# Altium project MegaD-328.PrjPcb
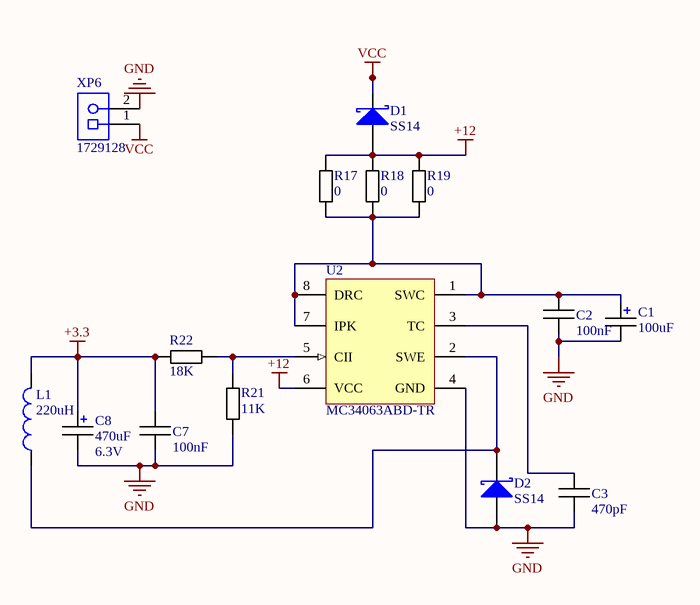
[diagram p0: Power.SchDoc]
3 sheets, 64 parts. Net scope: flat (ports and power ports of the same name join across sheets).
Board file: PCB.PcbDoc
Sheets:
  Power.SchDoc
  MCU.SchDoc
  LAN.SchDoc

## Sheet Power.SchDoc
size A4

### Parts
C1  Val: 100uF  [ECAP_SMD_6.3mmx5.4mm]  (hidden comment: CAP_ELEC_SMD)
C2  Val: 100nF  [CAPC1206(3216)170_L]  (hidden comment: CAP_SMD)
C3  Val: 470pF  [CAPC1206(3216)170_L]  (hidden comment: CAP_SMD)
C7  Val: 100nF  [CAPC1206(3216)170_L]  (hidden comment: CAP_SMD)
C8  Rated Capacitance: 470uF  Rated Voltage: 6.3V  [ECAP_SMD_8mmx10mm]  (hidden comment: CAP_ELEC_SMD)
D1  SS14  [DO-214]
D2  SS14  [DO-214]
L1  220uH  [SDR1006_SMD]
R17  Val: 0  [RESC1206(3216)_L]  (hidden comment: RES_SMD)
R18  Val: 0  [RESC1206(3216)_L]  (hidden comment: RES_SMD)
R19  Val: 0  [RESC1206(3216)_L]  (hidden comment: RES_SMD)
R21  Val: 11K  [RESC1206(3216)_L]  (hidden comment: RES_SMD)
R22  Val: 18K  [RESC1206(3216)_L]  (hidden comment: RES_SMD)
U2  MC34063ABD-TR  [SO-8_M]
XP6  1729128  [PHOE-1729128-2_V]

### Nets
+3.3: C7.2 C8.1 L1.2 R22.2
+12: D1.2(A) R17.2 R18.2 R19.2 U2.6(VCC)
GND: C1.2 C2.1 C3.1 C7.1 C8.2 D2.2(A) R21.2 U2.4(GND) XP6.2
VCC: D1.1(K) XP6.1
NetC1_1: C1.1 C2.2 R17.1 R18.1 R19.1 U2.1(SWC) U2.7(IPK) U2.8(DRC)
NetC3_2: C3.2 U2.3(TC)
NetD2_1: D2.1(K) L1.1 U2.2(SWE)
NetR21_1: R21.1 R22.1 U2.5(CII)

### Library data of the parts
C2 C3 C7 = CAP_SMD: Ceramic capacitor, 0805
D1 D2 = SS14: Schottky Rectifier, 1.1 W, -65 to 125 degC, 2-Pin SMD, RoHS, Tape and Reel; Manufacturer: Fairchild; Configuration: SINGLE; Diode Element Material: SILICON; Power Dissipation Limit-Max (W): 1.1; Additional Feature: FREEWHEELINGDIODE; Signal Diode Type: SIGNALDIODE; Number of Elements: 1; JEDEC-95 Code: DO-214AC; Rep Pk Reverse Voltage-Max (V): 40; Package Body Material: PLASTIC/EPOXY; CAGE Code: 1HBD3,07933,59621,7D893; Peak Reflow Temperature (Cel): 260; Package Shape: RECTANGULAR; Manufacturer URL: https://www.fairchildsemi.com/; JESD-97 Code: e3; Package Reference: DO-214AC-2; RoHS Compliant: YES; Package Description: 2-Pin Surface Mount Device, Body 4.375 x 2.725 mm; Technology: SCHOTTKY; Surface Mount: YES; Datasheet URL: http://www.onlinecomponents.com/datasheet/ss14.aspx?p=11369800; Terminal Form: CBEND; Package Style: SMALLOUTLINE; Number of Terminals: 2; JESD-30 Code: R-PDSO-C2; Average Forward Current-Max (A): 1; Terminal Finish: MATTETIN; Datasheet Version: Oct-13; Terminal Position: DUAL; Package URL: https://www.fairchildsemi.com/package-drawings/DO/DO214AC.pdf; Moisture Sensitivity Level: 1; Lead Free: YES
L1 = Inductor power: Inductor for Power Circuits; Manufacturer: TDK; Online Catalog: VLCFSeries; Catalog Drawings: VLCF50[20,20-(1,3),28-2]SeriesTopVLCF50[20,20-(1,3),28-2]SeriesFootprintVLCF50[20,20-(1,3)]SeriesSide; Current - Saturation: 2.62A; Frequency - Test: 100kHz; EDA / CAD Models: DownloadfromAcceleratedDesigns; Material - Core: Ferrite; Type: Wirewound; DC Resistance (DCR): 43mOhmMax; Inductance: 2.2µH; Tolerance: ±30%; Shielding: Shielded; Other Names: 445-4557-1; Size / Dimension: 0.197"Lx0.197"W(5.00mmx5.00mm); Datasheet Version: 04/2016; Package Description: 2-Pin Surface Mount Device, Body 5 x 5 mm; Package Reference: VLCF5020T-3; Package / Case: Nonstandard; Series: VLCF; Current Rating: 2.62A; Manufacturer URL: http://www.tdk.com/; Category: Inductors,Coils,Chokes; Height - Seated (Max): 0.079"(2.00mm); Mounting Technology: SurfaceMount; Family: FixedInductors; Datasheet URL: https://product.tdk.com/info/en/catalog/datasheets/inductor_commercial_power_vlcf5020-3_en.pdf; Standard Package: 1; Mounting Type: SurfaceMount; Operating Temperature: -40°C~105°C; Packaging: CutTape(CT)
R17-R19 R21 R22 = RES_SMD: RES0805
U2 = MC34063A: DC/DC converter control circuit, 8-Pin SO, Tape and Reel; PackageReference: SO8; DatasheetVersion: Nov-2007; PackageDescription: 8-Pin Small Outline Integrated Circuit 1.27 mm Pitch; ComponentLink3URL: http://www.st.com/internet/com/TECHNICAL_RESOURCES/TECHNICAL_LITERATURE/PACKAGE_INFORMATION/CD00004680.pdf; ComponentLink2Description: Datasheet; PackageVersion: Dec-2002; ComponentLink1URL: http://www.st.com; ComponentLink2URL: http://www.st.com/internet/com/TECHNICAL_RESOURCES/TECHNICAL_LITERATURE/DATASHEET/CD00001232.pdf; ComponentLink1Description: Manufacturer URL; ComponentLink3Description: Package Specification; Code_IPC: SOIC127P600-8; Code_JEDEC: MS-012-AA
XP6 = Terminal_2_Green: PCB Terminal Block, 13.5 A, 400 V, 2-Pin THD, RoHS, Bulk; Manufacturer: Phoenix Contact; Package Version: 03/2015; No. of Rows: 1; Pitch: 5.08mm; No. of Positions: 2; Voltage Rating: 400V; Current Rating: 13500mA; Manufacturer URL: http://www.phoenixcontact.com/; Datasheet URL: https://datasheet.ciiva.com/16046/1729128-16046181.pdf; RoHS: TRUE; Package URL: https://www.phoenixcontact.com/online/portal/pi/pxc/product_detail_page/!ut/p/b1/3VdJjqNKFDxLH8AFycySyWY2ozFsEPOMMQaDOX1XedGL_1Vdm5YXJleknhSKeBkvI6EA8ncAo3AYoDhBQGco6KN7VURTdemj9us_IEKEZo_YHiPAEWEFmDGOHMORkqKYCORBZxgL7ZoaZYcbFFUZ3fqxSY6GOuxydWUuHqz1ynmMFygu583Bob0Ewr6Sd_l-5m-kAueHiB0jpRwZwe58wwtkpxtMYd_LmGcDRU02dRNEyWt6Y2ti5pSyJ_reIkzIulrqApdnbT11V5jnCKbYNCvhEM1MCpPByat_X379-iThf08CI5GfOPqfBeS3BRoBOdD55AKVv0iLwCMq-2BrzXWSGRH7pUGD9uwXQjiph3xL0DKQwdGa0JImiIOmBNOestqgwTHSSs2oOep-78apyXQBvNi8ZLaFjvjWvcaUEBu0MC6Wbe-d6mB0FAebo2lUWinqYaZs5DAYzV0RP9yitUjnGJ0iI9xhZkT42OCQNUJJhkgWINNQLP2JFP6OpMg3JCVg70jqHT0lvKOnhHf0lPuOnnLf0VPuWx6_dxwUIvwk5WMkT0kLL1mh61l2yZVSzG3pYV_bqo-mj6uMKwKwdnnW8Jh5RTOJzMOA5c-eJDaZQw4mTMPH02PvS_ZAqNVjVTo2WyYLkwH_KU1mmmG5kjRhDqPXLwwVHvVOjCM60-fpXvTDfMGW1PVFVS1r4e4yVDk4ZdNbkUHvqPqQSeian4UD39fNKmachqdJ1NJbyk8rXT9mXTvPk3oE5meulKGgiruPJek-4I9hTT6G8ZLOyRSm2RRVbThERQad5OS28hdt4YW4vG0stgYYzsWsK4_7y6DZMjJSCqri1kyiZR5vD7pwIrNR7QwPHTcLTI5qT7eRlpHrdGiupYlqQDJ7zy_CND8fWWBoLRXxk1RVcXiBQwbTD4Xi7KL-FuO94t9xaqweXzH; PartNumber: 1729128; Package Description: 2-Pin Through Hole Device, Body 8.1 x 10.16 mm, Pitch 5.08 mm; Datasheet Version: 12/2013; Mounting Technology: ThroughHole; Orientation: Horizontal; Package Reference: 1729128-2; Packing: Bulk

## Sheet MCU.SchDoc
size A4
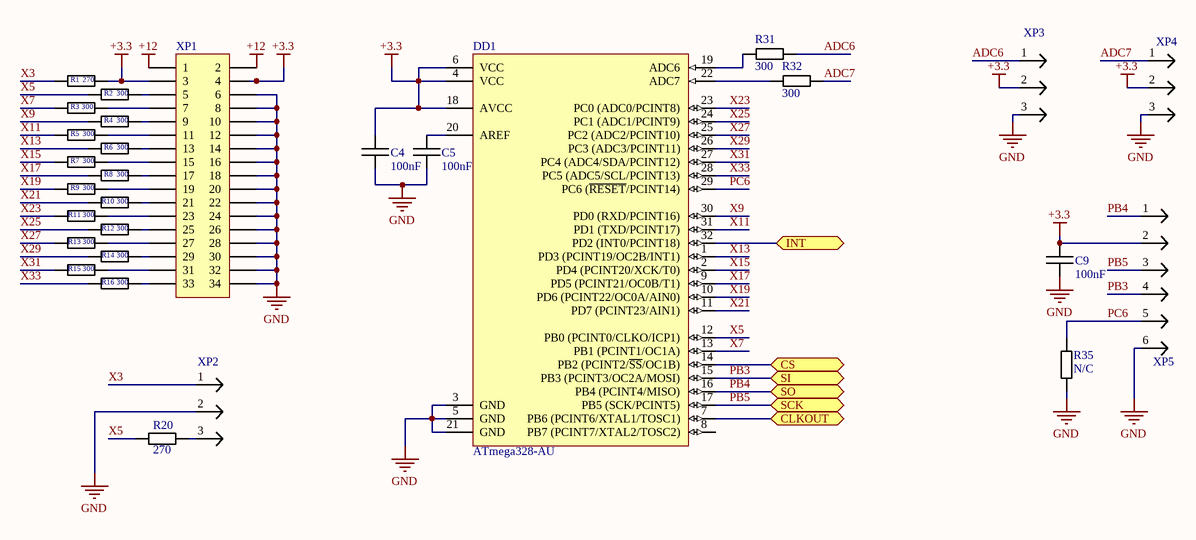
[diagram p1: MCU.SchDoc]

### Parts
C4  Val: 100nF  [CAPC1206(3216)170_L]  (hidden comment: CAP_SMD)
C5  Val: 100nF  [CAPC1206(3216)170_L]  (hidden comment: CAP_SMD)
C9  Val: 100nF  [CAPC1206(3216)170_L]  (hidden comment: CAP_SMD)
DD1  ATmega328-AU  [32A_L]
R1  Val: 270  [RESC1206(3216)_L]  (hidden comment: RES_SMD)
R2  Val: 300  [RESC1206(3216)_L]  (hidden comment: RES_SMD)
R3  Val: 300  [RESC1206(3216)_L]  (hidden comment: RES_SMD)
R4  Val: 300  [RESC1206(3216)_L]  (hidden comment: RES_SMD)
R5  Val: 300  [RESC1206(3216)_L]  (hidden comment: RES_SMD)
R6  Val: 300  [RESC1206(3216)_L]  (hidden comment: RES_SMD)
R7  Val: 300  [RESC1206(3216)_L]  (hidden comment: RES_SMD)
R8  Val: 300  [RESC1206(3216)_L]  (hidden comment: RES_SMD)
R9  Val: 300  [RESC1206(3216)_L]  (hidden comment: RES_SMD)
R10  Val: 300  [RESC1206(3216)_L]  (hidden comment: RES_SMD)
R11  Val: 300  [RESC1206(3216)_L]  (hidden comment: RES_SMD)
R12  Val: 300  [RESC1206(3216)_L]  (hidden comment: RES_SMD)
R13  Val: 300  [RESC1206(3216)_L]  (hidden comment: RES_SMD)
R14  Val: 300  [RESC1206(3216)_L]  (hidden comment: RES_SMD)
R15  Val: 300  [RESC1206(3216)_L]  (hidden comment: RES_SMD)
R16  Val: 300  [RESC1206(3216)_L]  (hidden comment: RES_SMD)
R20  Val: 270  [RESC1206(3216)_L]  (hidden comment: RES_SMD)
R31  Val: 300  [RESC1206(3216)_L]  (hidden comment: RES_SMD)
R32  Val: 300  [RESC1206(3216)_L]  (hidden comment: RES_SMD)
R35  Val: N/C  [RESC1206(3216)_L]  (hidden comment: RES_SMD)
XP1  (no value)  [HDR2X17]
XP2  PBS-03  [PBS-03]  (value not drawn)
XP3  PLS-03  [PLS-03]  (value not drawn)
XP4  PLS-03  [PLS-03]  (value not drawn)
XP5  PLS-03_2  [PLS-03_2]  (value not drawn)

### Ports
CLKOUT (bidir), CS (bidir), INT (bidir), SCK (bidir), SI (bidir), SO (bidir)

### Nets
+3.3: C4.2 C9.2 DD1.4(VCC) DD1.6(VCC) DD1.18(AVCC) R1.2 XP1.3 XP1.4 XP3.2 XP4.2 XP5.2
+12: XP1.1 XP1.2
GND: C4.1 C5.1 C9.1 DD1.3(GND) DD1.5(GND) DD1.21(GND) R35.1 XP1.6 XP1.8 XP1.10 XP1.12 XP1.14 XP1.16 XP1.18 XP1.20 XP1.22 XP1.24 XP1.26 XP1.28 XP1.30 XP1.32 XP1.34 XP2.2 XP3.3 XP4.3 XP5.6
ADC6: R31.2 XP3.1
ADC7: R32.2 XP4.1
PB3: DD1.15(PB3_(PCINT3/OC2A/MOSI)) XP5.4 ; port SI
PB4: DD1.16(PB4_(PCINT4/MISO)) XP5.1 ; port SO
PB5: DD1.17(PB5_(SCK/PCINT5)) XP5.3 ; port SCK
PC6: DD1.29(PC6_(~{RESET}/PCINT14)) R35.2 XP5.5
X3: R1.1 XP2.1
X5: DD1.12(PB0_(PCINT0/CLKO/ICP1)) R2.1 R20.1
X7: DD1.13(PB1_(PCINT1/OC1A)) R3.1
X9: DD1.30(PD0_(RXD/PCINT16)) R4.1
X11: DD1.31(PD1_(TXD/PCINT17)) R5.1
X13: DD1.1(PD3_(PCINT19/OC2B/INT1)) R6.1
X15: DD1.2(PD4_(PCINT20/XCK/T0)) R7.1
X17: DD1.9(PD5_(PCINT21/OC0B/T1)) R8.1
X19: DD1.10(PD6_(PCINT22/OC0A/AIN0)) R9.1
X21: DD1.11(PD7_(PCINT23/AIN1)) R10.1
X23: DD1.23(PC0_(ADC0/PCINT8)) R11.1
X25: DD1.24(PC1_(ADC1/PCINT9)) R12.1
X27: DD1.25(PC2_(ADC2/PCINT10)) R13.1
X29: DD1.26(PC3_(ADC3/PCINT11)) R14.1
X31: DD1.27(PC4_(ADC4/SDA/PCINT12)) R15.1
X33: DD1.28(PC5_(ADC5/SCL/PCINT13)) R16.1
NetC5_2: C5.2 DD1.20(AREF)
NetDD1_7: DD1.7(PB6_(PCINT6/XTAL1/TOSC1)) ; port CLKOUT
NetDD1_14: DD1.14(PB2_(PCINT2/~{SS}/OC1B)) ; port CS
NetDD1_19: DD1.19(ADC6) R31.1
NetDD1_22: DD1.22(ADC7) R32.1
NetDD1_32: DD1.32(PD2_(INT0/PCINT18)) ; port INT
NetR2_2: R2.2 XP1.5
NetR3_2: R3.2 XP1.7
NetR4_2: R4.2 XP1.9
NetR5_2: R5.2 XP1.11
NetR6_2: R6.2 XP1.13
NetR7_2: R7.2 XP1.15
NetR8_2: R8.2 XP1.17
NetR9_2: R9.2 XP1.19
NetR10_2: R10.2 XP1.21
NetR11_2: R11.2 XP1.23
NetR12_2: R12.2 XP1.25
NetR13_2: R13.2 XP1.27
NetR14_2: R14.2 XP1.29
NetR15_2: R15.2 XP1.31
NetR16_2: R16.2 XP1.33
NetR20_2: R20.2 XP2.3

Not connected (* = marked no-connect by the designer): DD1 8(PB7_(PCINT7/XTAL2/TOSC2))

### Library data of the parts
C4 C5 C9 = CAP_SMD: Ceramic capacitor, 0805
DD1 = ATmega328-AU: 8-bit AVR Microcontroller, 32KB Flash, 1KB EEPROM, 2KB SRAM, 32-pin TQFP, Industrial Grade (-40°C to 85°C); DatasheetVersion: revA, Jan-2010; PackageDescription: 32-Lead, 7x7x1.0 mm Body, 0.8mm Lead Pitch, Thin Profile Plastic Quad Flat Package (TQFP); PackageReference: 32A; Code_JEDEC: MS-026-ABA; PackageVersion: revB, Oct-2001
R1-R16 R20 R31 R32 R35 = RES_SMD: RES0805
XP1 = Header 17X2: Header, 17-Pin, Dual row; LatestRevisionDate: 17-Jul-2002; LatestRevisionNote: Re-released for DXP Platform.; Publisher: Altium Limited

## Sheet LAN.SchDoc
size A4
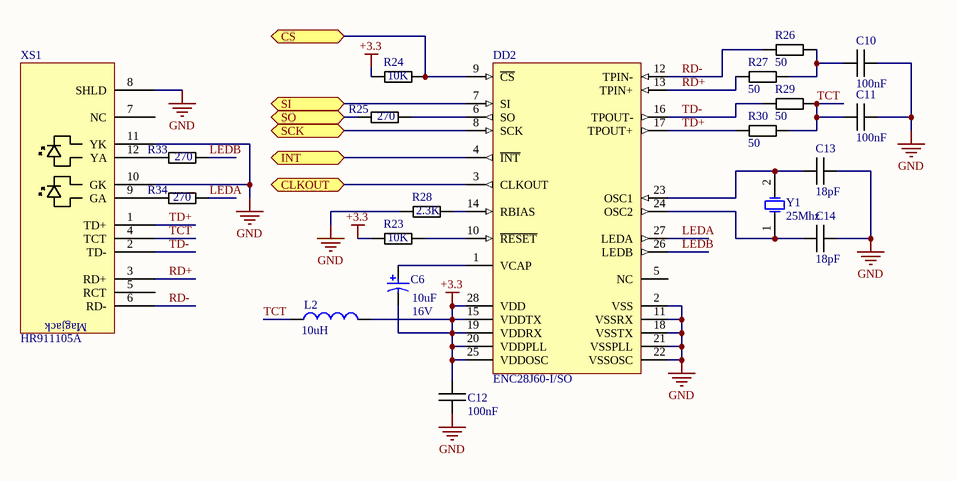
[diagram p2: LAN.SchDoc]

### Parts
C6  Capacitance: 10uF  Voltage: 16V  [CAP_3530]  (hidden comment: CAP_Tantalum)
C10  Val: 100nF  [CAPC1206(3216)170_L]  (hidden comment: CAP_SMD)
C11  Val: 100nF  [CAPC1206(3216)170_L]  (hidden comment: CAP_SMD)
C12  Val: 100nF  [CAPC1206(3216)170_L]  (hidden comment: CAP_SMD)
C13  Val: 18pF  [CAPC1206(3216)170_L]  (hidden comment: CAP_SMD)
C14  Val: 18pF  [CAPC1206(3216)170_L]  (hidden comment: CAP_SMD)
DD2  ENC28J60-I/SO  [SO-28_M]
L2  value 10uH  [IND_1206]  (hidden comment: Inductor)
R23  Val: 10K  [RESC1206(3216)_L]  (hidden comment: RES_SMD)
R24  Val: 10K  [RESC1206(3216)_L]  (hidden comment: RES_SMD)
R25  Val: 270  [RESC1206(3216)_L]  (hidden comment: RES_SMD)
R26  Val: 50  [RESC1206(3216)_L]  (hidden comment: RES_SMD)
R27  Val: 50  [RESC1206(3216)_L]  (hidden comment: RES_SMD)
R28  Val: 2.3K  [RESC1206(3216)_L]  (hidden comment: RES_SMD)
R29  Val: 50  [RESC1206(3216)_L]  (hidden comment: RES_SMD)
R30  Val: 50  [RESC1206(3216)_L]  (hidden comment: RES_SMD)
R33  Val: 270  [RESC1206(3216)_L]  (hidden comment: RES_SMD)
R34  Val: 270  [RESC1206(3216)_L]  (hidden comment: RES_SMD)
XS1  HR911105A  [HR911105A]
Y1  25Mhz  [Crystal_SMD]

### Ports
CLKOUT (bidir), CS (bidir), INT (bidir), SCK (bidir), SI (bidir), SO (bidir)

### Nets
+3.3: C6.2 C12.2 DD2.15(VDDTX) DD2.19(VDDRX) DD2.20(VDDPLL) DD2.25(VDDOSC) DD2.28(VDD) L2.2 R23.1 R24.1
GND: C10.2 C11.2 C12.1 C13.2 C14.2 DD2.2(VSS) DD2.11(VSSRX) DD2.18(VSSTX) DD2.21(VSSPLL) DD2.22(VSSOSC) R28.1 XS1.8(SHLD) XS1.10(GK) XS1.11(YK)
LEDA: DD2.27(LEDA) R34.2
LEDB: DD2.26(LEDB) R33.2
PB3: DD2.7(SI) ; port SI
PB4: R25.1 ; port SO
PB5: DD2.8(SCK) ; port SCK
RD+: DD2.13(TPIN+) R27.1 XS1.3(RD+)
RD-: DD2.12(TPIN-) R26.1 XS1.6(RD-)
TCT: C11.1 L2.1 R29.2 R30.2 XS1.4(TCT)
TD+: DD2.17(TPOUT+) R30.1 XS1.1(TD+)
TD-: DD2.16(TPOUT-) R29.1 XS1.2(TD-)
NetC6_1: C6.1 DD2.1(VCAP)
NetC10_1: C10.1 R26.2 R27.2
NetC13_1: C13.1 DD2.23(OSC1) Y1.2(X2)
NetC14_1: C14.1 DD2.24(OSC2) Y1.1(X1)
NetDD1_7: DD2.3(CLKOUT) ; port CLKOUT
NetDD1_14: DD2.9(~{CS}) R24.2 ; port CS
NetDD1_32: DD2.4(~{INT}) ; port INT
NetDD2_6: DD2.6(SO) R25.2
NetDD2_10: DD2.10(~{RESET}) R23.2
NetDD2_14: DD2.14(RBIAS) R28.2
NetR33_1: R33.1 XS1.12(YA)
NetR34_1: R34.1 XS1.9(GA)

Not connected (* = marked no-connect by the designer): DD2 5(NC); XS1 5(RCT) 7(NC)

### Notes on the sheet
- (in symbol RJ-45 HR911105A) Magjack

### Library data of the parts
C10-C14 = CAP_SMD: Ceramic capacitor, 0805
DD2 = ENC28J60-I/SO: Stand-Alone Ethernet Controller with SPI Interface, 28-Pin SOIC, Industrial Temperature; Code_JEDEC: MS-013; ComponentLink2URL: http://ww1.microchip.com/downloads/en/DeviceDoc/39662c.pdf; PackageDescription: 28-Lead Plastic Small Outline (SO) - Wide 7.50mm Body [SOIC]; RevisionNote: URLs added.; ComponentLink2Description: Datasheet; ComponentLink1Description: Manufacturer URL; ComponentLink3Description: Package Specification; DatasheetVersion: revC, Jan-2008; ComponentLink1URL: http://www.microchip.com/; ComponentLink3URL: http://www.microchip.com/stellent/groups/techpub_sg/documents/packagingspec/en012702.pdf; PackageVersion: revBB, Aug-2009; PackageReference: SOIC-SO28
R24 R28 R33 R34 = RES_SMD: RES0805
XS1 = RJ-45 HR911105A: Value: HR911105A; Order: HR911105A
Y1 = Crystal: Low Profile Crystal; Brand: ABRACON; Case Length: 11.4mm; Frequency Stability: 50PPM; ESR: 80Ohms; Case Height: 4.2mm; Tolerance: 30PPM; Frequency: 8MHz; Case Width: 4.7mm; Load Capacitance: 18pF; Datasheet Version: 04/2011; Termination Style: SMD/SMT; Dimensions: 4.7mmWx11.4mmLx4.2mmH; Packaging: Reel; Manufacturer: ABRACON; Package URL: http://www.abracon.com/Support/PackageDrawing/Resonators/ABLS-2D.pdf; Mounting Technology: SurfaceMount; Package Reference: ABLS-14.7456MHZ-B2-T; Product Category: Crystals; Package Description: 2-Pin Surface Mount Device, Body 11.4 x 4.7 mm; Package / Case: HC-49/US; Mounting Style: SMD/SMT; Operating Temperature Range: -20Cto+70C; Series: ABLS; Factory Pack Quantity: 1000; Datasheet URL: http://www.abracon.com/Resonators/abls.pdf; Manufacturer URL: http://www.abracon.com/; RoHS: Details; Type: LowProfileMicroprocessorCrystal

## Nets that join several sheets
+3.3: Power (C7.2 C8.1 L1.2 R22.2), MCU (11 pins), LAN (10 pins)
+12: Power (5 pins), MCU (XP1.1 XP1.2)
GND: Power (9 pins), MCU (26 pins), LAN (14 pins)
NetDD1_7: MCU (DD1.7), LAN (DD2.3)
NetDD1_14: MCU (DD1.14), LAN (DD2.9 R24.2)
NetDD1_32: MCU (DD1.32), LAN (DD2.4)
PB3: MCU (DD1.15 XP5.4), LAN (DD2.7)
PB4: MCU (DD1.16 XP5.1), LAN (R25.1)
PB5: MCU (DD1.17 XP5.3), LAN (DD2.8)